# Altium schematic sheet PCB_Schematic.SchDoc
size A; SheetNumber: 1; SheetTotal: 1; SPICEModelCacheQGHOYSEU: <root> / <DocumentId>QGHOYSEU</DocumentId> / <CacheFrame Number="0"> / <Model Name="860020672006_2.2uf" Kind="CKT"> / <Text>******* / .subckt 860020672006_2.2uF 1 2 / Rser 1 3 2.32277177427 / Lser 2 4 5.676908907E-09 / C1 3 4 0.0000022 / Rpar 3 4 16666666.6666667 / .ends 860020672006_2.2uF</Text> / </Model> / </CacheFrame> / </root>
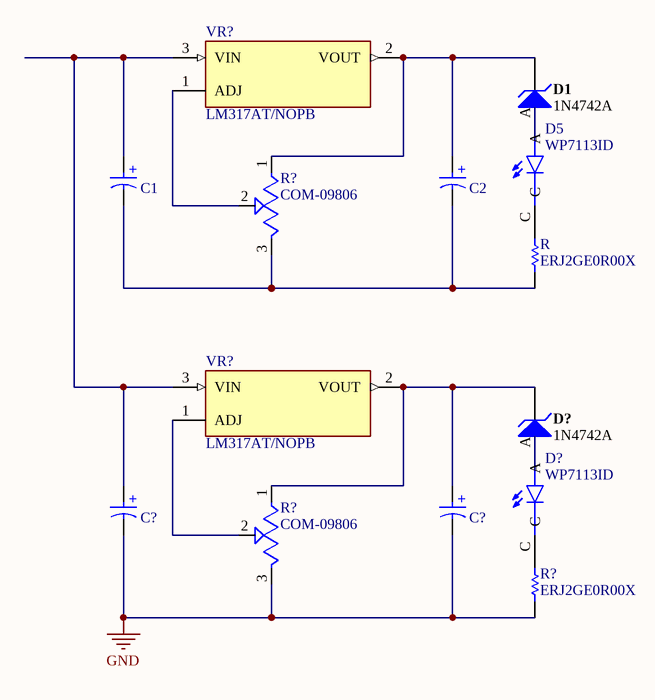
[diagram p0: PCB_Schematic.SchDoc]

## Parts
(Parts that share a designator on the sheet are numbered #1, #2 ... from top to bottom, then left to right.)
C1  2.2µF  [WCAP-ATG5_D5H11]  (value not drawn)
C2  1.1uF  [WCAP-ATG5_D5H11]  (value not drawn)
C?#1  2.2µF  [WCAP-ATG5_D5H11]  (value not drawn)
C?#2  1.1uF  [WCAP-ATG5_D5H11]  (value not drawn)
D1  1N4742A  [FAIR-DO-41-2_V]
D5  WP7113ID  [LED_WP7113ID]
D?#1  1N4742A  [FAIR-DO-41-2_V]
D?#2  WP7113ID  [LED_WP7113ID]
R  ERJ2GE0R00X  [RESC1005X40X25LL05T05]
R?#1  COM-09806  [TRIM_COM-09806]
R?#2  COM-09806  [TRIM_COM-09806]
R?#3  ERJ2GE0R00X  [RESC1005X40X25LL05T05]
VR?#1  LM317AT/NOPB  [TO254P1054X470X1955-3]
VR?#2  LM317AT/NOPB  [TO254P1054X470X1955-3]

## Nets
GND: C?#1.2(N) C?#2.2(N) R?#2.3(CW) R?#3.1
NetC1_1: C1.1(P) C?#1.1(P) VR?#1.3(VIN) VR?#2.3(VIN)
NetC1_2: C1.2(N) C2.2(N) R.1 R?#1.3(CW)
NetC2_1: C2.1(P) D1.2(K) R?#1.1(CCW) VR?#1.2(VOUT)
NetC?#2_1: C?#2.1(P) D?#1.2(K) R?#2.1(CCW) VR?#2.2(VOUT)
NetD1_1: D1.1(A) D5.A
NetD5_C: D5.C R.2
NetD?#1_1: D?#1.1(A) D?#2.A
NetD?#2_C: D?#2.C R?#3.2
NetR?#1_2: R?#1.2(WIPER) VR?#1.1(ADJ)
NetR?#2_2: R?#2.2(WIPER) VR?#2.1(ADJ)

## Notes on the sheet
- (in symbol 860020672006) +

## Library data of the parts
C1 C2 C?#1 C?#2 = 860020672006: WCAP-ATG5 Aluminum Electrolytic Capacitor, Radial, THT, D5 x H11mm, 2.2µF, 50V; Manufacturer: Wurth Elektronik; Capacitance Tolerance: +/-20%; Dissipation Factor: 10%; Endurance: 2000h; Leakage Current: 3µA; Ripple Current: 20mA; Technical Reference: ATDC1102R2M050DSPA3B000; Manufacturer Part Number: 860020672006; Category: Aluminum Electrolytic Capacitors; Match Code: WCAP-ATG5; ComponentLink1Description: Website Link; ComponentLink1URL: https://www.we-online.com/redexpert/article/860020672006?ad; ComponentLink2Description: Datasheet Link; ComponentLink2URL: https://www.we-online.com/redexpert/spec/860020672006?ad; Mount: Through Hole; Operating Temperature Max: 105°C; Operating Temperature Min: -40°C; Packaging: Ammo Pack; Height: 11mm; Diameter: 5mm; Capacitance: 2.2µF; Rated Voltage (DC): 50V
D1 D?#1 = CMP-0892-00001-1: Zener Diode, 12V, 1W, 5%, -65 to 200 degC, 2-Pin DO-41, Body 2.72 x 5.2 mm, RoHS; Manufacturer: Fairchild Semiconductor; PD (W): 1; VZ (Min.) (V): 11.4; VZ (Max.) (V): 12.6; ZZ (Max) (ohm): 8; IR (uA): 5; Test Current IZ (mA): 21; PartNumber: 1N4742A; PackageVersion: Rev. 2; DatasheetVersion: Rev. H3; Mounting Technology: Through Hole; Tolerance: 5%; PackageDescription: 2-Pin Axial leaded, Body 2.72 x 5.2 mm, Lead Spread 25.4 mm; ComponentLink1Description: Manufacturer URL; ComponentLink3Description: Package Specification; ComponentLink2Description: Datasheet; ComponentLink2URL: http://www.fairchildsemi.com/ds/1N/1N4744A.pdf; PackageReference: DO-41-2; RoHS: TRUE; Operating and Storage Temperature Range: -65 to 200 degC; ComponentLink3URL: http://www.fairchildsemi.com/dwg/DO/DO41A.pdf; ComponentLink1URL: http://www.fairchildsemi.com/
D5 D?#2 = WP7113ID: Red 617nm LED Indication - Discrete 2V Radial; MF: Kingbright; Price: None; MP: WP7113ID; Package: Radial Kingbright; Check_prices: https://www.snapeda.com/parts/WP7113ID/Kingbright/view-part/?ref=eda; Purchase-URL: https://pricing.snapeda.com/search/part/WP7113ID/?ref=eda; Availability: In Stock; Value: *; SnapEDA_Link: https://www.snapeda.com/parts/WP7113ID/Kingbright/view-part/?ref=snap
R R?#3 = CMP-2000-07451-1: Chip Resistor, 0 Ohm, 0.1 W, -55 to 155 degC, 0402 (1005 Metric), RoHS, Tape and Reel; Manufacturer: Panasonic; Voltage Rating (DC): 50V; Temperature Coefficient: 600ppm/��C; Max Power Dissipation: 100mW; Resistance: 0mOhm; Tolerance: 5%; Number of Terminations: 2; Mount: SurfaceMount; Height: 0.35mm; Packaging: TapeandReel; Contact Plating: Tin; Manufacturer URL: http://www.panasonic.com/; Composition: ThickFilm; Max Operating Temperature: 155degC; REACH SVHC: NoSVHC; Case/Package: 0402; Package Reference: 402; Depth: 0.5mm; Package Description: 2-Pin Surface Mount Device, Body 1 x 0.5 mm; Datasheet URL: https://industrial.panasonic.com/cdbs/www-data/pdf/RDA0000/AOA0000C301.pdf; RoHSCompliant: True; Case Code (Imperial): 0402; Military Standard: Not; Min Operating Temperature: -55degC; Power Rating: 100mW; Datasheet Version: 03/2015; Length: 1mm; Case Code (Metric): 1005; Termination: SMD/SMT; Mounting Technology: SurfaceMount; Voltage Rating: 50V; Width: 0.02inch; Package Quantity: 1; Lead Free: LeadFree; Radiation Hardening: No
R?#1 R?#2 = COM-09806: 10 kOhms 0.5W, 1/2W PC Pins Through Hole Trimmer Potentiometer Cermet 1 Turn Top Adjustment; Package: None; Price: None; Value: *; MP: COM-09806; Availability: Unavailable
VR?#1 VR?#2 = LM317AT/NOPB: MP: LM317AT/NOPB; Availability: Unavailable; Value: *; Package: None; Price: None